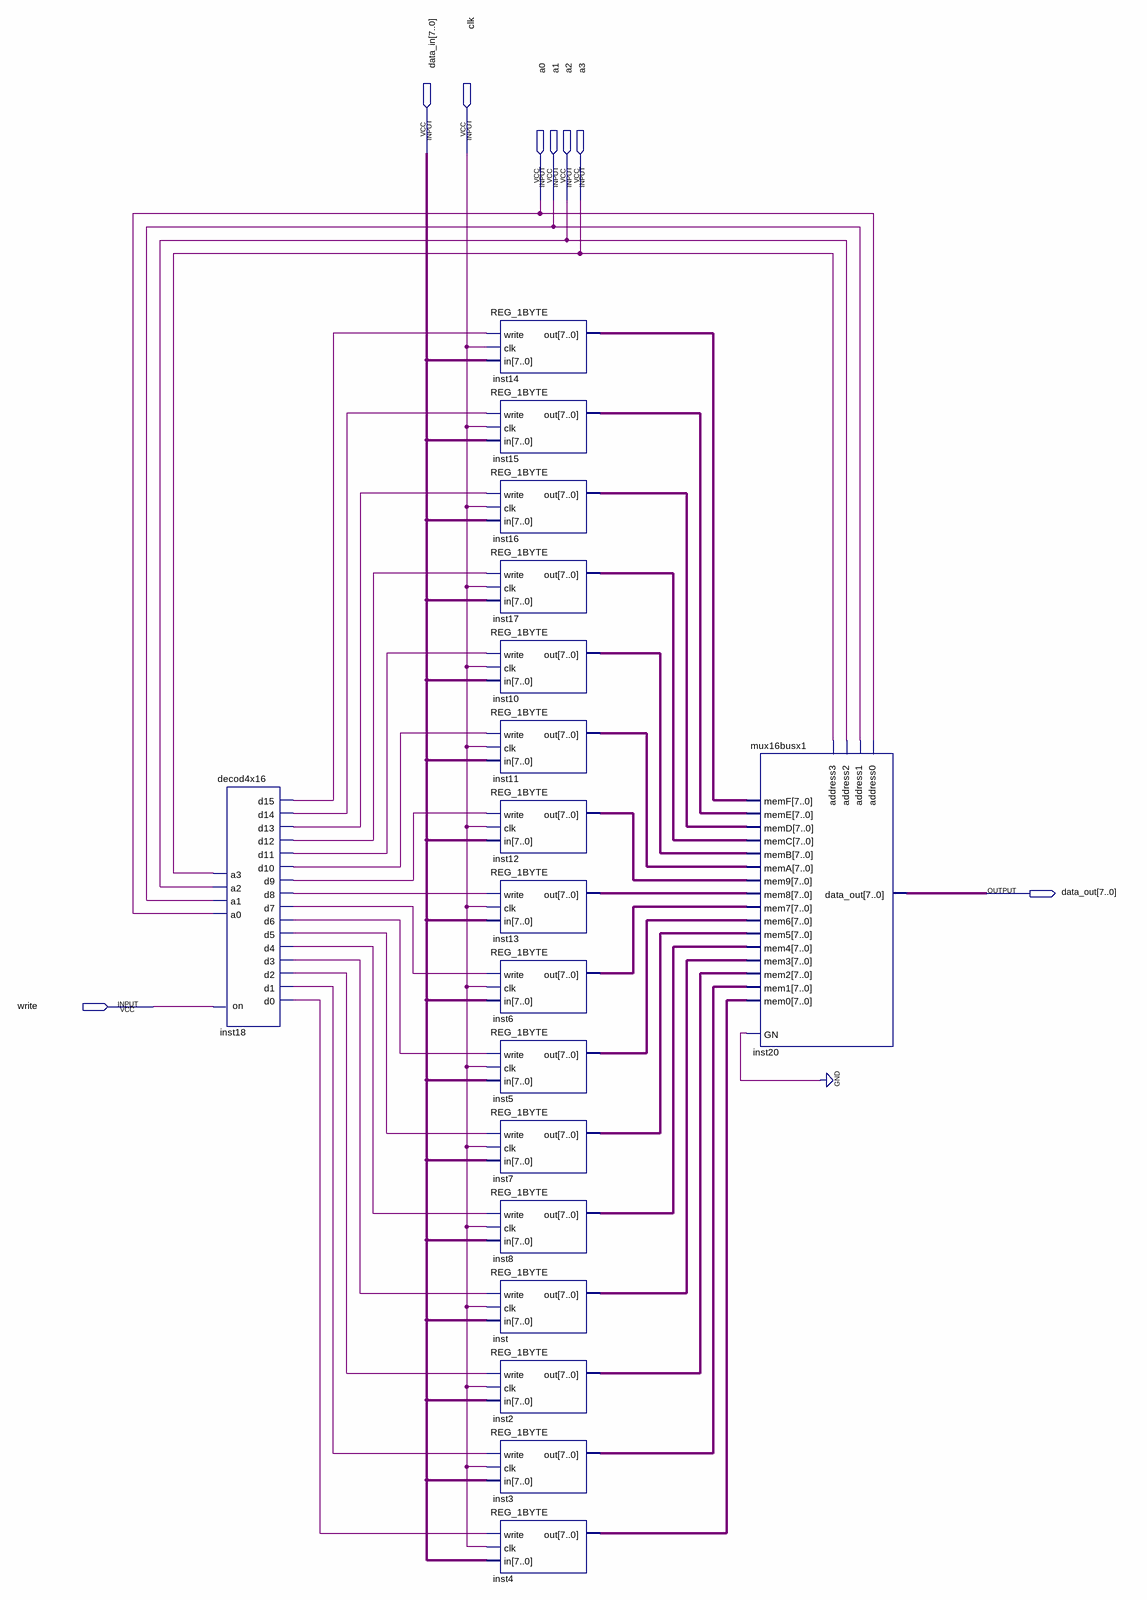
[diagram p0: schematic sheet]
// Quartus schematic MEM_16ADD.bdf as structural Verilog: 18 symbols, 8 pins
module MEM_16ADD (
  input  [7:0] data_in,
  input  clk,
  input  a0,
  input  a1,
  input  a2,
  input  a3,
  input  write,
  output [7:0] data_out
);

  wire inst18_d0, inst18_d1, inst18_d2, inst18_d3, inst18_d4, inst18_d5, inst18_d6, inst18_d7, inst18_d8,
       inst18_d9, inst18_d10, inst18_d11, inst18_d12, inst18_d13, inst18_d14, inst18_d15;
  wire [7:0] inst2_out, inst3_out, inst4_out, inst5_out, inst6_out, inst7_out, inst8_out, inst10_out,
       inst11_out, inst12_out, inst13_out, inst14_out, inst15_out, inst16_out, inst17_out, inst_out;

  decod4x16 inst18 (
    .a3(a3), .a2(a2), .on(write), .a1(a1), .a0(a0), .d15(inst18_d15), .d14(inst18_d14), .d13(inst18_d13),
    .d12(inst18_d12), .d11(inst18_d11), .d10(inst18_d10), .d9(inst18_d9), .d8(inst18_d8), .d7(inst18_d7),
    .d6(inst18_d6), .d5(inst18_d5), .d4(inst18_d4), .d3(inst18_d3), .d2(inst18_d2), .d1(inst18_d1),
    .d0(inst18_d0));
  REG_1BYTE inst14 (.write(inst18_d15), .clk(clk), .in(data_in), .out(inst14_out));
  REG_1BYTE inst15 (.write(inst18_d14), .clk(clk), .in(data_in), .out(inst15_out));
  REG_1BYTE inst16 (.write(inst18_d13), .clk(clk), .in(data_in), .out(inst16_out));
  REG_1BYTE inst17 (.write(inst18_d12), .clk(clk), .in(data_in), .out(inst17_out));
  REG_1BYTE inst10 (.write(inst18_d11), .clk(clk), .in(data_in), .out(inst10_out));
  REG_1BYTE inst11 (.write(inst18_d10), .clk(clk), .in(data_in), .out(inst11_out));
  REG_1BYTE inst12 (.write(inst18_d9), .clk(clk), .in(data_in), .out(inst12_out));
  REG_1BYTE inst13 (.write(inst18_d8), .clk(clk), .in(data_in), .out(inst13_out));
  REG_1BYTE inst6 (.write(inst18_d7), .clk(clk), .in(data_in), .out(inst6_out));
  REG_1BYTE inst5 (.write(inst18_d6), .clk(clk), .in(data_in), .out(inst5_out));
  REG_1BYTE inst7 (.write(inst18_d5), .clk(clk), .in(data_in), .out(inst7_out));
  REG_1BYTE inst8 (.write(inst18_d4), .clk(clk), .in(data_in), .out(inst8_out));
  REG_1BYTE inst (.write(inst18_d3), .clk(clk), .in(data_in), .out(inst_out));
  REG_1BYTE inst2 (.write(inst18_d2), .clk(clk), .in(data_in), .out(inst2_out));
  REG_1BYTE inst3 (.write(inst18_d1), .clk(clk), .in(data_in), .out(inst3_out));
  REG_1BYTE inst4 (.write(inst18_d0), .clk(clk), .in(data_in), .out(inst4_out));
  mux16busx1 inst20 (
    .memF(inst14_out), .memE(inst15_out), .memD(inst16_out), .memC(inst17_out), .memB(inst10_out),
    .memA(inst11_out), .mem9(inst12_out), .mem8(inst13_out), .mem7(inst6_out), .mem6(inst5_out),
    .mem5(inst7_out), .mem4(inst8_out), .mem3(inst_out), .mem2(inst2_out), .mem1(inst3_out),
    .mem0(inst4_out), .GN(1'b0), .address0(a0), .address1(a1), .address2(a2), .address3(a3),
    .data_out(data_out));
endmodule
